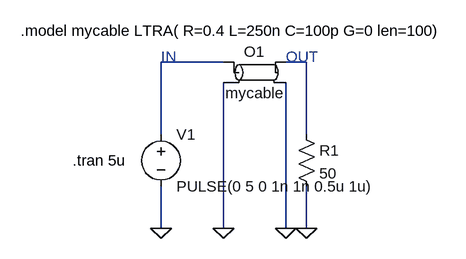
[diagram p0: schematic Q2) Signal Transmission through Wired Media.asc]
Q2) Signal Transmission through Wired Media.asc, the LTspice schematic file:
Version 4
SHEET 1 880 680
WIRE 192 -16 96 -16
WIRE 320 -16 288 -16
WIRE 96 96 96 -16
WIRE 320 96 320 -16
WIRE 96 240 96 176
WIRE 192 240 192 16
WIRE 288 240 288 16
WIRE 320 240 320 176
FLAG 96 240 0
FLAG 192 240 0
FLAG 288 240 0
FLAG 320 240 0
SYMBOL voltage 96 80 R0
WINDOW 123 0 0 Left 0
WINDOW 39 0 0 Left 0
SYMATTR InstName V1
SYMATTR Value PULSE(0 5 0 1n 1n 0.5u 1u)
SYMBOL res 304 80 R0
SYMATTR InstName R1
SYMATTR Value 50
SYMBOL ltline 240 0 R0
SYMATTR InstName O1
SYMATTR Value mycable
TEXT -120 -64 Left 2 !.model mycable LTRA( R=0.4 L=250n C=100p G=0 len=100)
TEXT 96 -24 Left 2 ;IN
TEXT 288 -24 Left 2 ;OUT
TEXT -40 136 Left 2 !.tran 5u

The netlist it stands for:
* Q2) Signal Transmission through Wired Media.asc
V1 N001 0 PULSE(0 5 0 1n 1n 0.5u 1u)
R1 N002 0 50
O1 N001 0 N002 0 mycable
.model mycable LTRA( R=0.4 L=250n C=100p G=0 len=100)
* IN
* OUT
.tran 5u
.backanno
.end